# Altium schematic sheet io_power.SchDoc
size A4
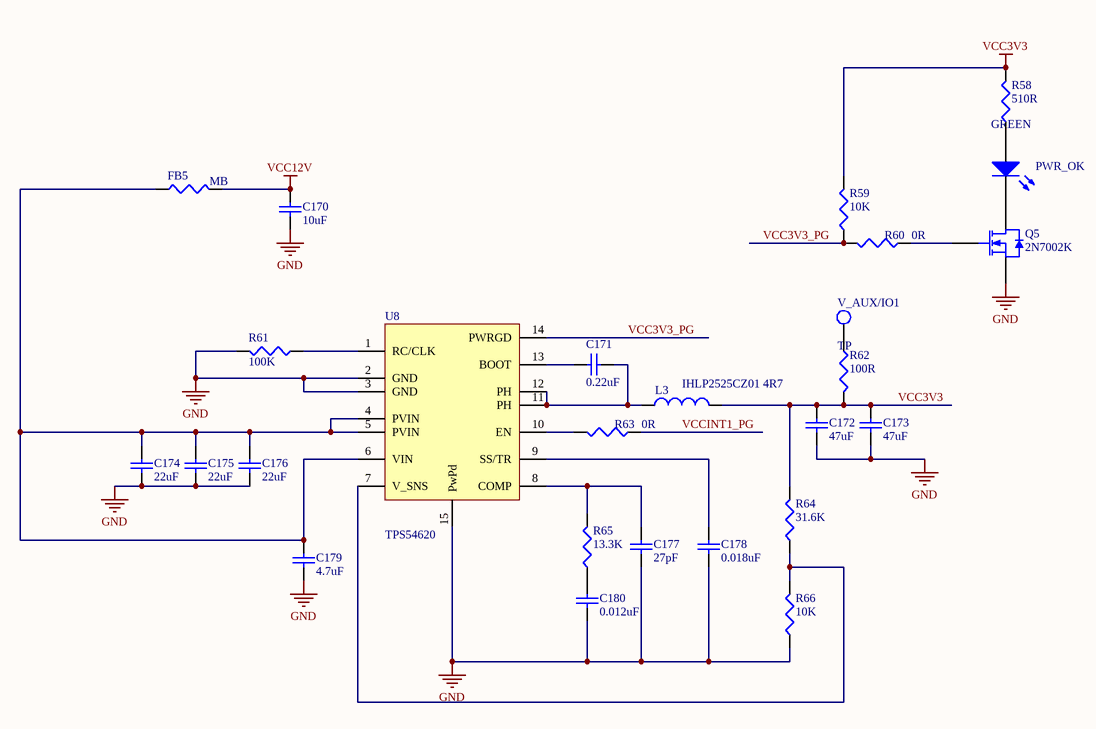
[diagram p0: io_power.SchDoc]

## Parts
C170  10uF  [CAPC3216N]
C171  0.22uF  [CAPC1608N]
C172  47uF  [CAPC3225N]
C173  47uF  [CAPC3225N]
C174  22uF  [CAPC3225N]
C175  22uF  [CAPC3225N]
C176  22uF  [CAPC3225N]
C177  27pF  [CAPC1608N]
C178  0.018uF  [CAPC1608N]
C179  4.7uF  [CAPC2012N]
C180  0.012uF  [CAPC1608N]
FB5  MB  [INDC3216N]
L3  IHLP2525CZ01  value 4R7  [IHLP2525]
PWR_OK  GREEN  [CD1608-0603]
Q5  2N7002K  [SOT23_N]
R58  510R  [RESC1005N]
R59  10K  [RESC1608N]
R60  0R  [RESC1005N]
R61  100K  [RESC1005N]
R62  100R  [RESC1005N]
R63  0R  [RESC1005N]
R64  31.6K  [RESC1608N]
R65  13.3K  [RESC1608N]
R66  10K  [RESC1608N]
U8  TPS54620  [VQFN-14]
V_AUX/IO1  TP  [PIN1]

## Nets
GND: C170.1 C172.1 C173.1 C174.1 C175.1 C176.1 C177.1 C178.1 C179.1 C180.1 Q5.2(S) R61.2 R66.1 U8.2(GND) U8.3(GND) U8.15(PwPd)
VCC3V3: C172.2 C173.2 L3.2 R58.2 R59.2 R62.2 R64.2
VCC12V: C170.2 FB5.2
VCC3V3_PG: R59.1 R60.2 U8.14(PWRGD)
VCCINT1_PG: R63.1
NetC171_1: C171.1 U8.13(BOOT)
NetC171_2: C171.2 L3.1 U8.11(PH) U8.12(PH)
NetC174_2: C174.2 C175.2 C176.2 C179.2 FB5.1 U8.4(PVIN) U8.5(PVIN) U8.6(VIN)
NetC177_2: C177.2 R65.2 U8.8(COMP)
NetC178_2: C178.2 U8.9(SS/TR)
NetC180_2: C180.2 R65.1
NetPWR_OK_1: PWR_OK.1(A) R58.1
NetPWR_OK_2: PWR_OK.2(K) Q5.3(D)
NetQ5_1: Q5.1(G) R60.1
NetR61_1: R61.1 U8.1(RC/CLK)
NetR62_1: R62.1 V_AUX/IO1.1(TP)
NetR63_2: R63.2 U8.10(EN)
NetR64_1: R64.1 R66.2 U8.7(V_SNS)

## Library data of the parts
C170 = Cap Semi: Capacitor (Semiconductor SIM Model); Published: 8-Jun-2000; LatestRevisionDate: 29-May-2009; LatestRevisionNote: IPC-7351 Footprint Added.; PackageReference: C1206; Publisher: Altium Limited; PackageDescription: Chip Capacitor; Value: 10uF
C171 C177 C178 C180 = C0603: Ceramic Chip Capacitor - Standard; Note: Footprint corresponds to dimensions for bulk cassette packaging. This case size has tightened tolerances.; Published: 17-Jul-2002; LatestRevisionDate: 19-Mar-2004; LatestRevisionNote: Silkscreen size reduced.; DatasheetDocument: Mar-2001; PackageDocument: Mar-2001; PackageReference: 0603; Publisher: Altium Limited; Code_JEITA: 0603; Code_IPC: 1608 [0603]; ComponentLink1Description: Manufacturer Link; ComponentLink1URL: http://www.kemet.com/; ComponentLink2Description: Datasheet; ComponentLink2URL: http://www.kemet.com/kemet/web/homepage/kechome.nsf/vapubfilesname/F3102TA.pdf/$file/F3102TA.pdf
  C171: Value: 0.22uF
  C177: Value: 27pF
  C178: Value: 0.018uF
  C180: Value: 0.012uF
C172-C176 = C1210: Ceramic Chip Capacitor - Standard; Published: 17-Jul-2002; LatestRevisionDate: 19-Mar-2004; LatestRevisionNote: Silkscreen size reduced.; DatasheetDocument: Mar-2001; PackageDocument: Mar-2001; PackageReference: 1210; Publisher: Altium Limited; Code_JEITA: 1210; Code_IPC: 3225 [1210]; ComponentLink1Description: Manufacturer Link; ComponentLink1URL: http://www.kemet.com/; ComponentLink2Description: Datasheet; ComponentLink2URL: http://www.kemet.com/kemet/web/homepage/kechome.nsf/vapubfilesname/F3102TA.pdf/$file/F3102TA.pdf
  C172 C173: Value: 47uF
  C174-C176: Value: 22uF
C179 = C0805: Ceramic Chip Capacitor - Standard; Note: Footprint corresponds to dimensions for bulk cassette packaging. This case size has tightened tolerances.; Published: 17-Jul-2002; LatestRevisionDate: 19-Mar-2004; LatestRevisionNote: Silkscreen size reduced.; DatasheetDocument: Mar-2001; PackageDocument: Mar-2001; PackageReference: 0805; Publisher: Altium Limited; Code_JEITA: 0805; Code_IPC: 2012[0805]; ComponentLink1Description: Manufacturer Link; ComponentLink1URL: http://www.kemet.com/; ComponentLink2Description: Datasheet; ComponentLink2URL: http://www.kemet.com/kemet/web/homepage/kechome.nsf/vapubfilesname/F3102TA.pdf/$file/F3102TA.pdf; Value: 4.7uF
FB5 R58-R66 = Res3: Resistor; Published: 8-Jun-2000; LatestRevisionDate: 29-May-2009; LatestRevisionNote: IPC-7351 Footprint Added.; PackageReference: J1-0603; Publisher: Altium Limited; PackageDescription: Chip Resistor
  FB5: Value: MB
  R58: Value: 510R
  R59 R66: Value: 10K
  R60 R63: Value: 0R
  R61: Value: 100K
  R62: Value: 100R
  R64: Value: 31.6K
  R65: Value: 13.3K
L3 = Inductor: Code_IEC: 1005; Published: 8-Jun-2000; LatestRevisionDate: 29-May-2009; LatestRevisionNote: IPC-7351 Footprint Added.; PackageReference: 0402-A; Publisher: Altium Limited; PackageDescription: Chip Inductor; Code_JEITA: 0402
PWR_OK = LED3: Typical BLUE SiC LED; Published: 8-Jun-2000; LatestRevisionDate: 17-Dec-2003; LatestRevisionNote: PCB Footprint replaced.; DatasheetVersion: 16-Apr-2002; PackageVersion: 16-Apr-2002; PackageReference: 3.5X2.8X1.9; Publisher: Altium Limited; PackageDescription: SM LED; 2 C-Bend Leads; Body 3.5 x 2.8 x 1.9 mm, inc leads (LxWxH typ)
Q5 = 2N7002: N-channel Enhancement Mode Field-effect Transistor; Published: 17-Sep-2003; LatestRevisionDate: 12-Dec-2006; LatestRevisionNote: IPC-7351 Footprint Added.; DatasheetVersion: 27-Jul-2000; PackageVersion: May-1999; PackageReference: SOT23; Publisher: Altium Limited; PackageDescription: 3-Pin SOT-23 Package 0.95 mm Pitch, 2.3 mm Lead Span; ComponentLink1Description: Manufacturer Link; ComponentLink1URL: http://www.semiconductors.philips.com/; ComponentLink2Description: Datasheet; ComponentLink2URL: http://www.semiconductors.philips.com/acrobat/datasheets/2N7002_4.pdf